# EAGLE design LZ3003_3 (EAGLE 7.7.0)
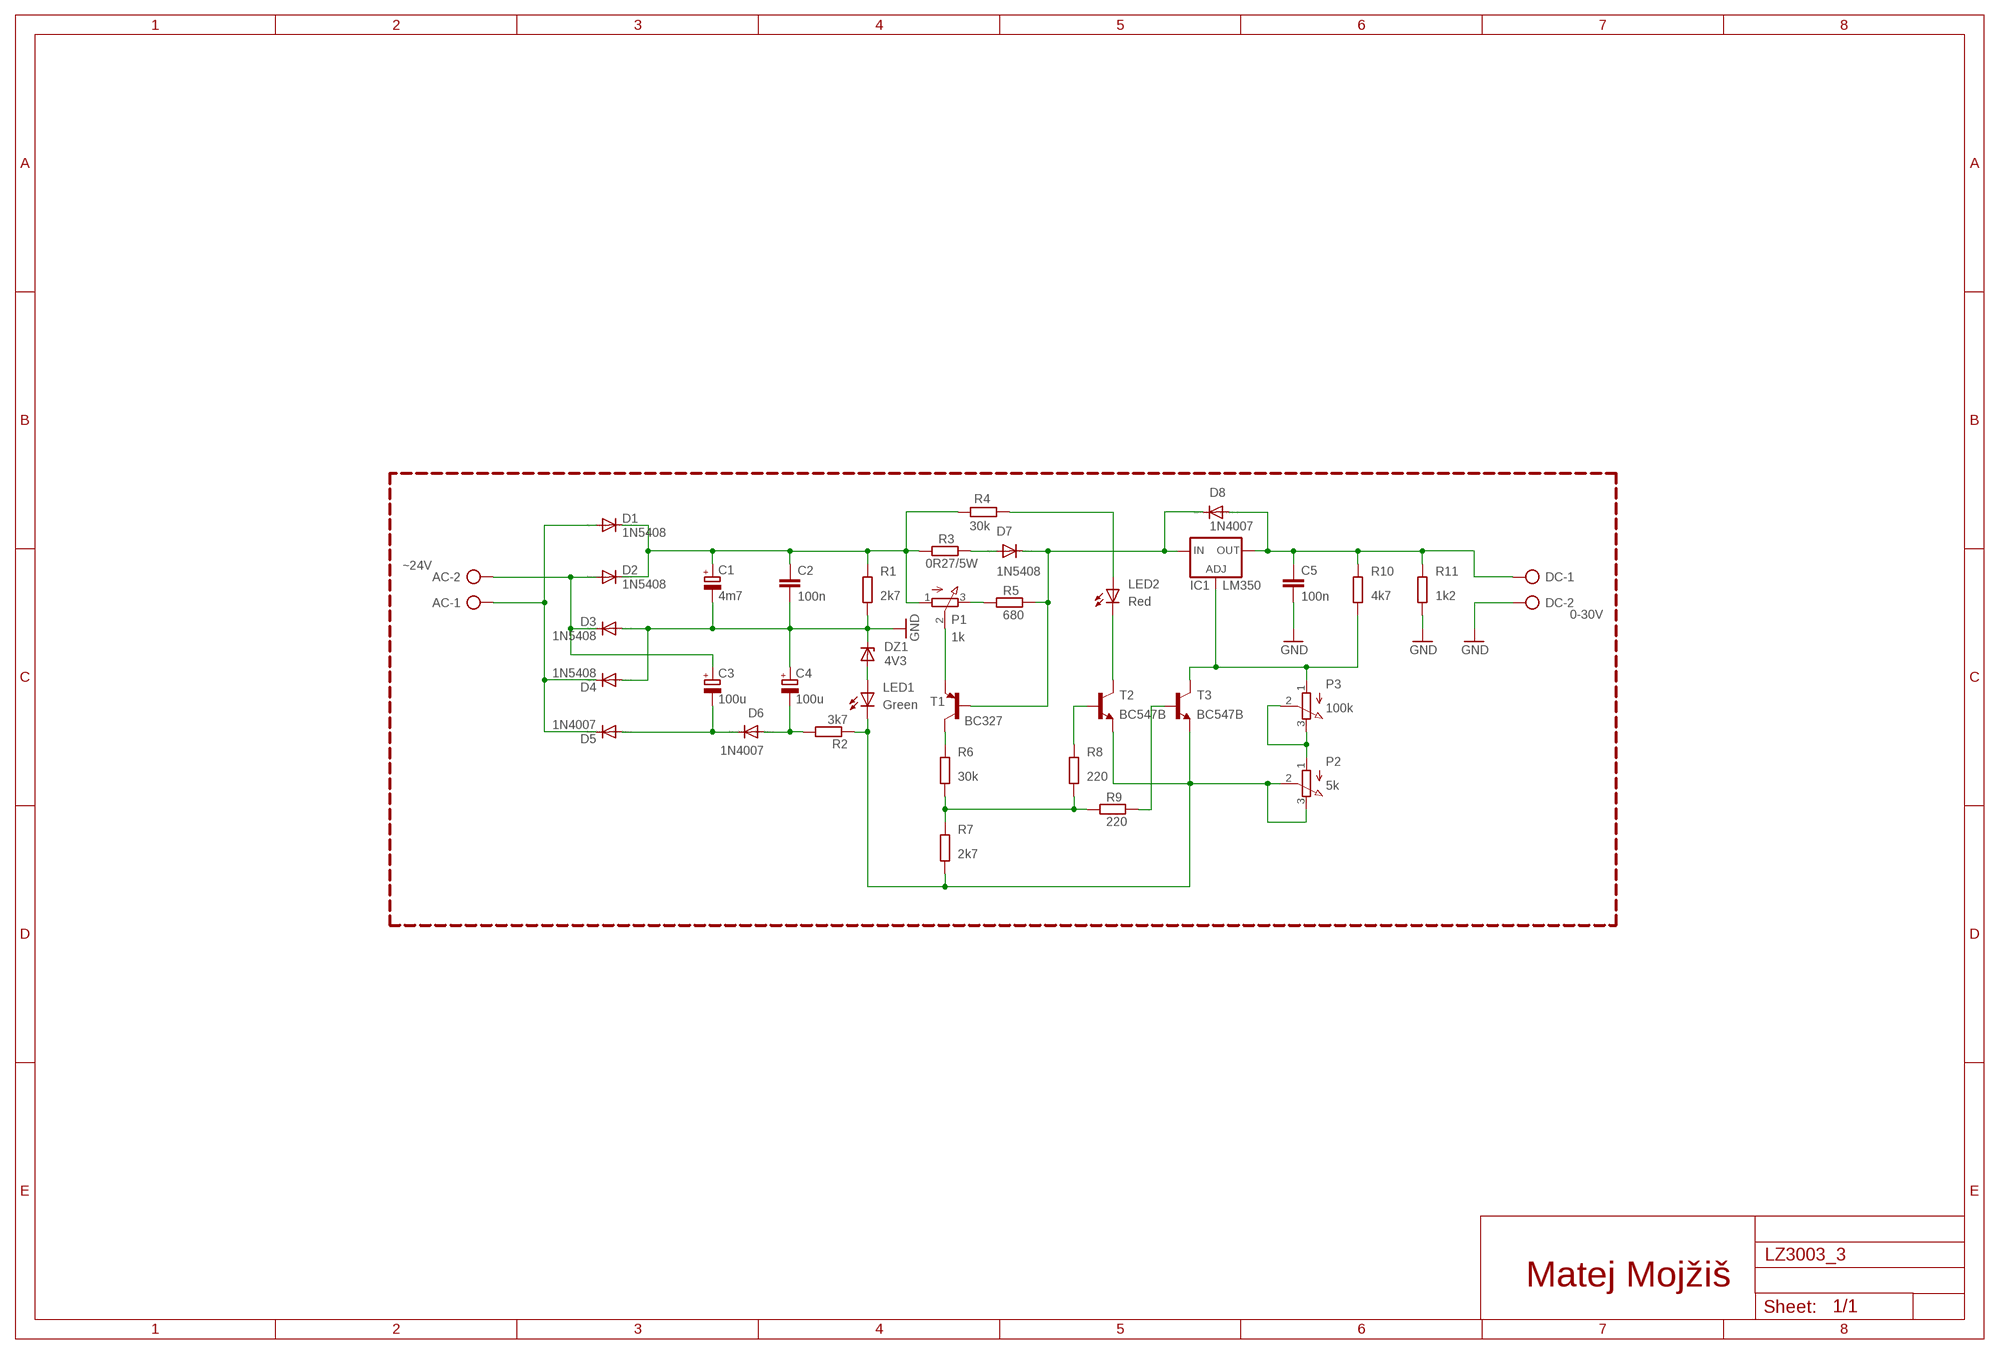
[diagram p0: schematic, sheet 1]

## Parts
AC  ~24V  W237-102  [W237-102]
C1  4m7  CPOL-EUE7.5-16  [E7,5-16]
C2  100n  C-EU050-025X075  [C050-025X075]
C3  100u  CPOL-EUE5-8.5  [E5-8,5]
C4  100u  CPOL-EUE5-8.5  [E5-8,5]
C5  100n  C-EU050-025X075  [C050-025X075]
D1  1N5408  1N5400  [DO201-15]
D2  1N5408  1N5400  [DO201-15]
D3  1N5408  1N5400  [DO201-15]
D4  1N5408  1N5400  [DO201-15]
D5  1N4007  1N4004  [DO41-10]
D6  1N4007  1N4004  [DO41-10]
D7  1N5408  1N5400  [DO201-15]
D8  1N4007  1N4004  [DO41-10]
DC  0-30V  W237-102  [W237-102]
DZ1  4V3  ZENER-DIODEDO34-7  [DO34Z7]
IC1  LM350  LM317TS  [317TS]
LED1  Green  LED5MM  [LED5MM]
LED2  Red  LED5MM  [LED5MM]
P1  1k  3RP/1610N  [3RP/1610N]
P2  5k  3RP/1610N  [3RP/1610N]
P3  100k  3RP/1610N  [3RP/1610N]
R1  2k7  R-EU_0207/7  [0207/7]
R2  3k7  R-EU_0207/7  [0207/7]
R3  0R27/5W  R-EU_0617/22  [0617/22]
R4  30k  R-EU_0207/7  [0207/7]
R5  680  R-EU_0207/7  [0207/7]
R6  30k  R-EU_0207/7  [0207/7]
R7  2k7  R-EU_0207/7  [0207/7]
R8  220  R-EU_0207/7  [0207/7]
R9  220  R-EU_0207/7  [0207/7]
R10  4k7  R-EU_0207/7  [0207/7]
R11  1k2  R-EU_0207/7  [0207/7]
T1  BC327  [TO92-EBC]
T2  BC547B  BC547B-NPN-TO92-CBE  [TO92-CBE]
T3  BC547B  BC547B-NPN-TO92-CBE  [TO92-CBE]

## Nets
ADJ: IC1.1(ADJ) P3.1(A) R10.1 T3.C
ADJ1: P2.1(A) P3.2(S) P3.3(E)
C: R6.2 T1.C
CC: LED2.K(C) T2.C
DC11: C3.- D5.A D6.C
DC+: C1.+ C2.1 D1.C D2.C P1.1(A) R1.1 R3.1 R4.2
DC-: LED1.K(C) P2.2(S) P2.3(E) R2.1 R7.1 T2.E T3.E
E: P1.2(S) T1.E
GND: C1.- C2.2 C4.+ C5.2 D3.A D4.A DC.2 DZ1.C R1.2 R11.1
IN: D7.C D8.C IC1.3(IN) R5.2 T1.B
L: AC.2 C3.+ D2.A D3.C
LIM: D7.A R3.2
LIMM: LED2.A R4.1
LMMM: C4.- D6.A R2.2
N: AC.1 D1.A D4.C D5.C
OUT: C5.1 D8.A DC.1 IC1.2(OUT) R10.2 R11.2
SET: R9.2 T3.B
SET1: R6.1 R7.2 R8.1 R9.1
SETT: P1.3(E) R5.1
SETTT: R8.2 T2.B
ZEN: DZ1.A LED1.A

## Notes on the sheet
- Matej Mojžiš

## Library data of the parts
AC DC = con-wago-500:W237-102: WAGO SCREW CLAMP; MPN: 237-102; OC_FARNELL: unknown; OC_NEWARK: 70K9898
C1 C3 C4 = rcl:CPOL-EU: POLARIZED CAPACITOR, European symbol
C2 C5 = rcl:C-EU: CAPACITOR, European symbol
D1-D4 D7 = diode:1N5400: DIODE standard rectifier, 3 A, 50 V (Motorola)
D5 D6 D8 = diode:1N4004: DIODE general purpose rectifier, 1 A
DZ1 = diode:ZENER-DIODE: Z-Diode
IC1 = v-reg:LM317TS: VOLTAGE REGULATOR
LED1 LED2 = led:LED: LED OSRAM: - CHIPLED LG R971, LG N971, LY N971, LG Q971, LY Q971, LO R971, LY R971 LH N974, LH R974 LS Q976, LO Q976, LY Q976 LO Q996 - Hyper CHIPLED LW Q18S LB Q993, LB Q99A, LB R99A - SideLED LS A670, LO A670, LY A670, LG A670, LP A670 LB A673, LV A673, LT A673, LW A673 LH A674 LY A675 LS A676, LA A676, LO A676, LY A676, LW A676 LS A679, LY A679, LG A679 - Hyper Micro SIDELED® LS Y876, LA Y876, LO Y876, LY Y876 LT Y87S - SmartLED LW L88C, LW L88S LB L89C, LB L89S, LG L890 LS L89K, LO L89K, LY L89K LS L896, LA L896, LO L896, LY L896 - TOPLED LS T670, LO T670, LY T670, LG T670, LP T670 LSG T670, LSP T670, LSY T670, LOP T670, LYG T670 LG T671, LOG T671, LSG T671 LB T673, LV T673, LT T673, LW T673 LH T674 LS T676, LA T676, LO T676, LY T676, LB T676, LH T676, LSB T676, LW T676 LB T67C, LV T67C, LT T67C, LS T67K, LO T67K, LY T67K, LW E67C LS E67B, LA E67B, LO E67B, LY E67B, LB E67C, LV E67C, LT E67C LW T67C LS T679, LY T679, LG T679 LS T770, LO T770, LY T770, LG T770, LP T770 LB T773, LV T773, LT T773, LW T773 LH T774 LS E675, LA E675, LY E675, LS T675 LS T776, LA T776, LO T776, LY T776, LB T776 LHGB T686 LT T68C, LB T68C - Hyper Mini TOPLED® LB M676 - Mini TOPLED Santana® LG M470 LS M47K, LO M47K, LY M47K Source: http://www.osram.convergy.de LUXEON: - LUMILED® LXK2-PW12-R00, LXK2-PW12-S00, LXK2-PW14-U00, LXK2-PW14-V00 LXK2-PM12-R00, LXK2-PM12-S00, LXK2-PM14-U00 LXK2-PE12-Q00, LXK2-PE12-R00, LXK2-PE12-S00, LXK2-PE14-T00, LXK2-PE14-U00 LXK2-PB12-K00, LXK2-PB12-L00, LXK2-PB12-M00, LXK2-PB14-N00, LXK2-PB14-P00, LXK2-PB14-Q00 LXK2-PR12-L00, LXK2-PR12-M00, LXK2-PR14-Q00, LXK2-PR14-R00 LXK2-PD12-Q00, LXK2-PD12-R00, LXK2-PD12-S00 LXK2-PH12-R00, LXK2-PH12-S00 LXK2-PL12-P00, LXK2-PL12-Q00, LXK2-PL12-R00 Source: www.luxeon.com KINGBRIGHT: KA-3528ASYC Source: www.kingbright.com
P1-P3 = pot:3RP/1610N: 16mm Potentiometer one level Source: http://www.alphapotentiometers.net/html/16mm_pot_2.html
R1-R11 = rcl:R-EU_: RESISTOR, European symbol
T1 = transistor-pnp:BC327*: PNP Transistror
T2 T3 = transistor:*-NPN-: NPN Transistror BF959 corrected 2008.03.06

## Board
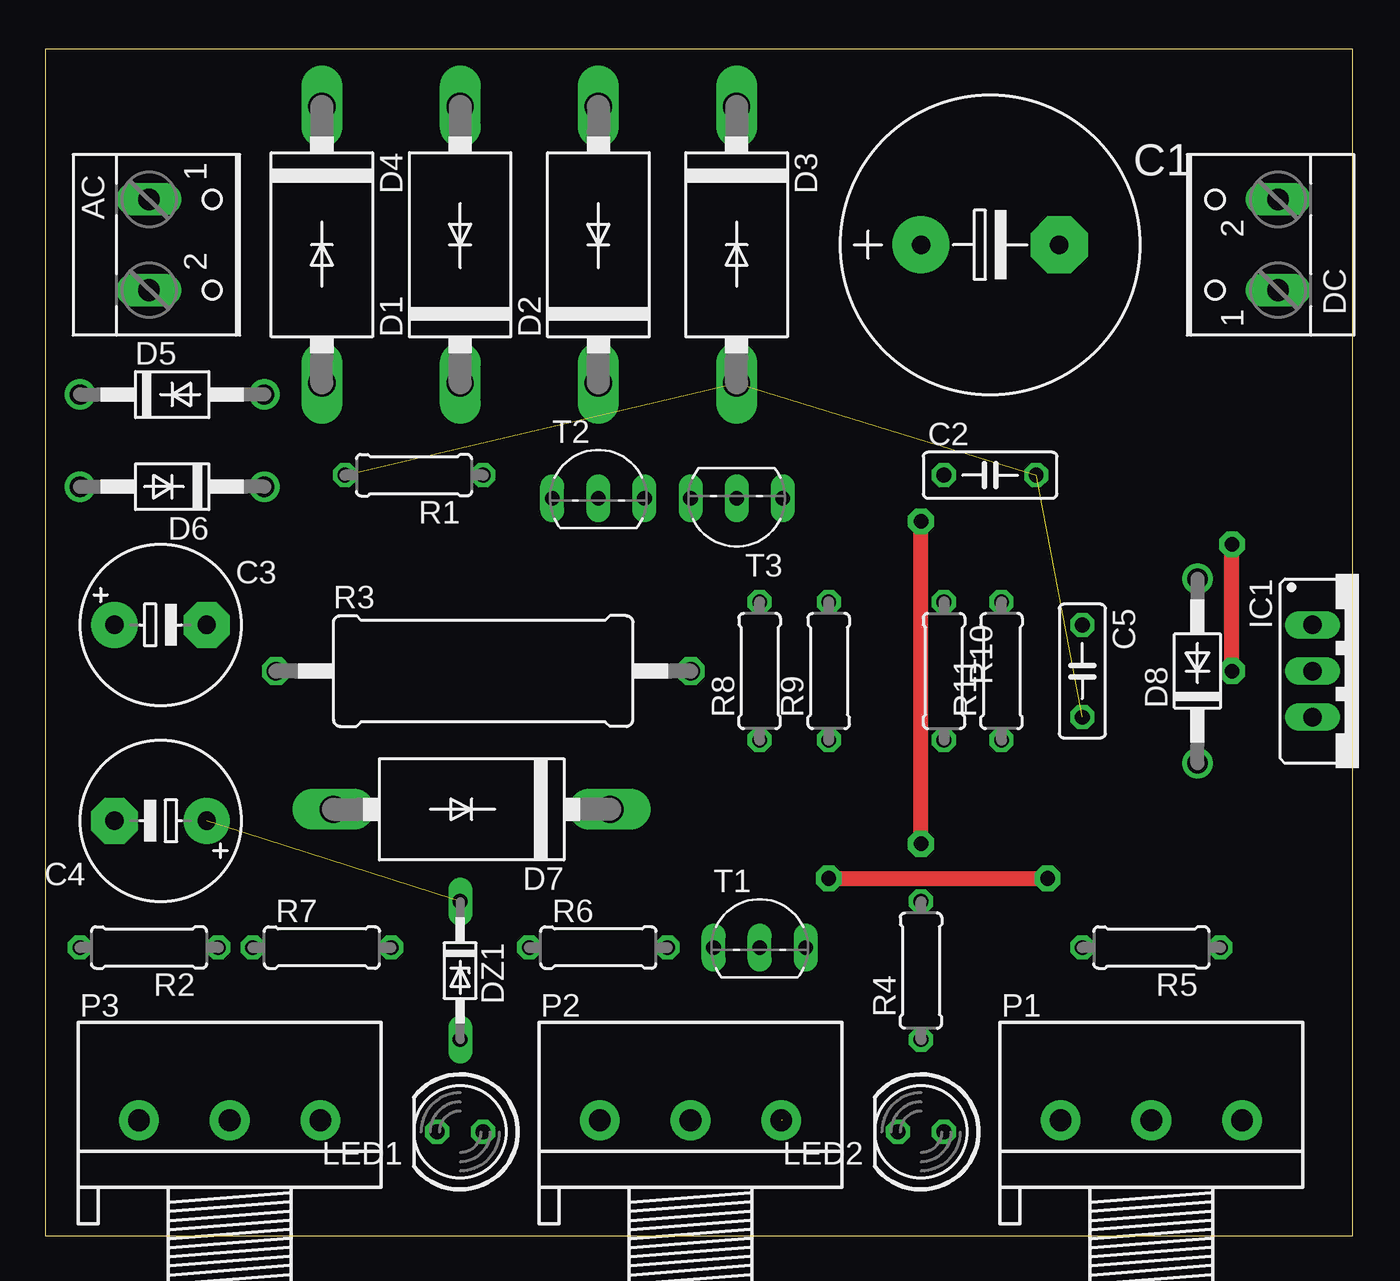
[diagram p1: board, top side]
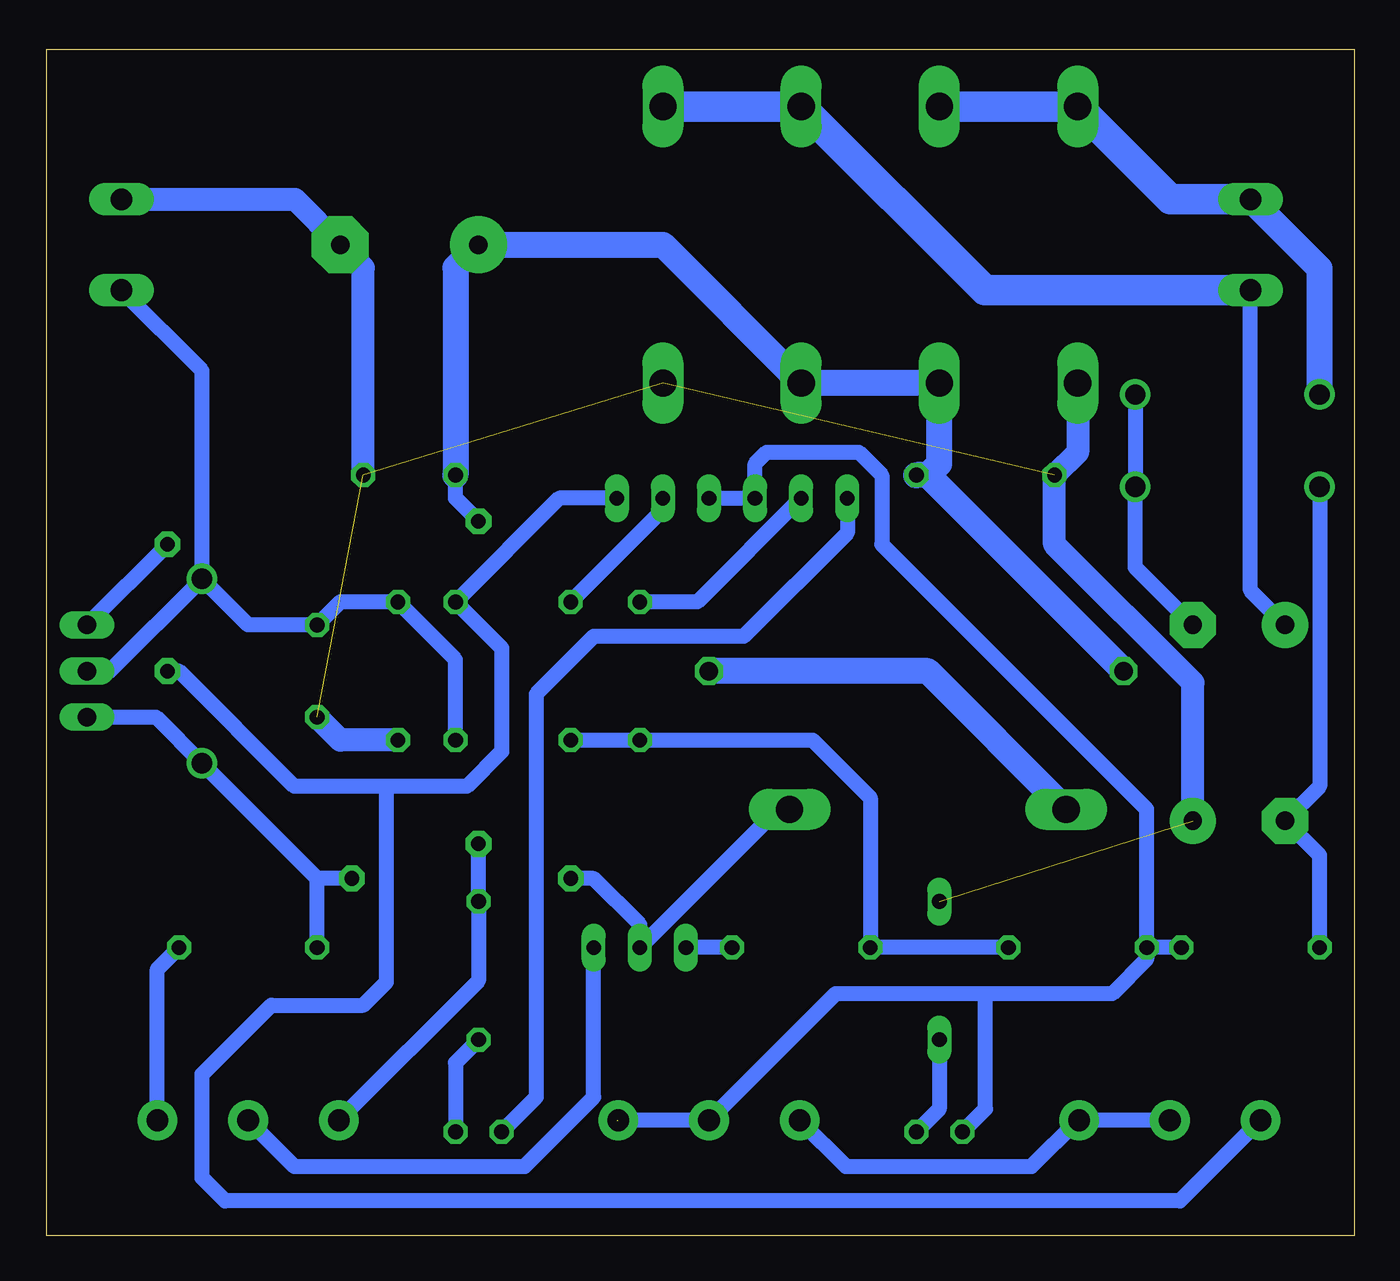
[diagram p2: board, bottom side, seen from below]

Size 72.06 x 65.39 mm. Coordinates in mm from the lower left corner, seen from the top.
Outline: 0,0 72.06,0 72.06,65.39 0,65.39 0,0
Copper layers (1*16): Top 0.035mm / dielectric 1.5mm / Bottom 0.035mm
Design rules "default": minimum track width 10mil, minimum drill 24mil, track to track 8mil, track to pad 8mil, pad to pad 8mil, via to via 8mil, smd to smd 8mil, copper to edge 40mil, drill to drill 8mil, minimum pad ring 10mil, minimum via ring 8mil, stop-mask expansion 4mil, vias tented up to drill 0mil, thermal gap 10mil

### Footprints (pad centres in the part's own frame; a part is rotated, then mirrored left to right if it is on the bottom)
W237-102 = drill 1.194 long: 1 -2.5,-1.27; 2 2.5,-1.27
E7,5-16 = drill 1.016 pad 3.15: + -3.81,0 | drill 1.016 pad 3.15 octagon: - 3.81,0
C050-025X075 = drill 0.813 octagon: 1 -2.54,0; 2 2.54,0
E5-8,5 = drill 1.016 pad 2.54: + -2.54,0 | drill 1.016 pad 2.54 octagon: - 2.54,0
DO201-15 = drill 1.499 long: A 7.62,0; C -7.62,0
DO41-10 = drill 1.118: A 5.08,0; C -5.08,0
DO34Z7 = drill 0.813 long: A 3.81,0; C -3.81,0
317TS = drill 1.016 long: 1 -2.54,-2.54; 2 0,-2.54; 3 2.54,-2.54
LED5MM = drill 0.813 octagon: A -1.27,0; K 1.27,0
3RP/1610N = drill 1.2 pad 2.184: 1 -5,0; 2 0,0; 3 5,0
0207/7 = drill 0.813 octagon: 1 -3.81,0; 2 3.81,0
0617/22 = drill 1.016 octagon: 1 -11.43,0; 2 11.43,0
TO92-EBC = drill 0.813 long: B 0,-1.27; C -2.54,-1.27; E 2.54,-1.27
TO92-CBE = drill 0.813 long: B 0,0; C -2.54,0; E 2.54,0

### Placement (x,y rotation side)
AC  6.99,54.61 270 top
C1  52.07,54.61 0 top
C2  52.07,41.91 0 top
C3  6.35,33.66 0 top
C4  6.35,22.86 180 top
C5  57.15,31.11 270 top
D1  22.86,54.61 90 top
D2  30.48,54.61 90 top
D3  38.1,54.61 270 top
D4  15.24,54.61 270 top
D5  6.99,46.35 0 top
D6  6.99,41.27 180 top
D7  23.5,23.5 180 top
D8  63.5,31.11 90 top
DC  66.67,54.61 90 top
DZ1  22.86,14.61 270 top
IC1  72.39,31.11 270 top
LED1  22.86,5.71 180 top
LED2  48.26,5.71 180 top
P1  60.96,6.35 0 top
P2  35.56,6.35 0 top
P3  10.16,6.35 0 top
R1  20.32,41.91 180 top
R2  5.71,15.88 180 top
R3  24.13,31.11 0 top
R4  48.26,14.61 90 top
R5  60.96,15.88 180 top
R6  30.48,15.88 0 top
R7  15.24,15.88 0 top
R8  39.37,31.11 90 top
R9  43.18,31.11 90 top
R10  49.53,31.11 270 top
R11  52.7,31.11 90 top
T1  39.37,17.14 0 top
T2  30.48,40.64 0 top
T3  38.1,40.64 180 top

### Tracks (layer width: path | path; a pad name or v marks a point on that pad's centre or on a via)
ADJ  (via drill 0.8 pad 1.42)
  Top 0.813: v65.41,31.11 v65.41,38.1
  Bottom 0.813: T3.C 43.81,40.64 R10.1 46.99,32.38 46.99,26.67 48.9,24.77 53.34,24.77 | 53.34,24.77 58.42,24.77 64.77,31.11 v65.41,31.11 | P3.1 9.61,1.91 62.23,1.91 63.5,3.17 63.5,8.89 59.69,12.7 54.61,12.7 53.34,13.97 53.34,24.77 | v65.41,38.1 IC1.1
ADJ1
  Bottom 0.813: P3.2 P3.3 15.24,6.35 17.78,3.81 28.02,3.81 P2.1
C
  Bottom 0.813: R6.2 T1.C
CC
  Bottom 0.813: T2.C 27.94,38.73 33.66,33.02 41.91,33.02 45.09,29.84 45.09,7.62 LED2.K
DC11
  Bottom 0.813: D5.A D6.C 12.06,36.83 C3.-
DC+  (via drill 0.8 pad 1.42)
  Top 0.813: v48.26,21.59 v48.26,39.37
  Bottom 0.813: P1.1 48.26,14.05 R4.2 v48.26,21.59 | v48.26,39.37 49.53,40.64 C2.1
  Bottom 1.422: R3.1 23.5,41.91 | 23.5,41.91 R1.1 | 23.5,41.91 22.86,42.55 D1.C D2.C 38.1,54.61 C1.+ 49.53,53.34 C2.1
DC-  (1 unrouted)
  Bottom 0.813: T3.E T2.E 33.02,42.55 32.38,43.18 27.3,43.18 26.04,41.91 26.04,38.1 11.43,23.5 R7.1 | R2.1 R7.1 | 40.64,6.35 P2.2 28.57,13.34 20.32,13.34 | R7.1 11.43,15.24 13.34,13.34 20.32,13.34 | LED1.K 20.32,6.99 20.32,13.34
E
  Bottom 0.813: P1.2 58.42,3.81 45.72,3.81 41.91,7.62 T1.E
GND  (4 unrouted)
  Bottom 1.27: D4.A 15.24,43.18 R1.2 16.51,38.1 8.89,30.48 C4.+ | R11.1 55.88,27.3 C5.2 | C2.2 54.61,53.34 C1.- 58.38,57.11 DC.2
IN  (via drill 0.8 pad 1.42)
  Top 0.813: v43.18,19.68 v55.24,19.68
  Bottom 0.813: R5.2 57.15,19.68 | 57.15,19.68 D8.C 66.04,28.57 IC1.3 | D7.C 31.75,23.5 T1.B 39.37,17.14 41.91,19.68 v43.18,19.68 | v55.24,19.68 57.15,19.68
L
  Bottom 0.813: C3.+ 5.71,35.56 AC.2
  Bottom 1.676: D3.C D2.A 20.36,52.11 AC.2
LIM
  Bottom 1.422: D7.A 23.5,31.11 R3.2
LIMM
  Bottom 0.813: R4.1 49.53,9.53 LED2.A
LMMM
  Bottom 0.813: D6.A 1.91,24.77 C4.- 1.91,20.95 R2.2
N
  Bottom 1.422: D5.C 1.91,53.3 AC.1
  Bottom 1.676: D1.A D4.C 10.12,57.11 AC.1
OUT
  Bottom 0.813: IC1.2 68.58,31.11 D8.A | D8.A 60.96,33.66 C5.1 55.88,34.92 R11.2 49.53,31.75 R10.2 | D8.A 63.5,47.66 DC.1
SET
  Bottom 0.813: T3.B 38.1,40.01 R9.2
SET1
  Bottom 0.813: R7.2 R6.1 26.67,24.13 29.84,27.3 R8.1 R9.1
SETT
  Bottom 0.813: P1.3 65.96,14.69 R5.1
SETTT
  Bottom 0.813: T2.B 36.2,34.92 R8.2
ZEN
  Bottom 0.813: DZ1.A 22.86,6.99 LED1.A